# Altium project SVFC.PrjPcb (part 10 of 10)
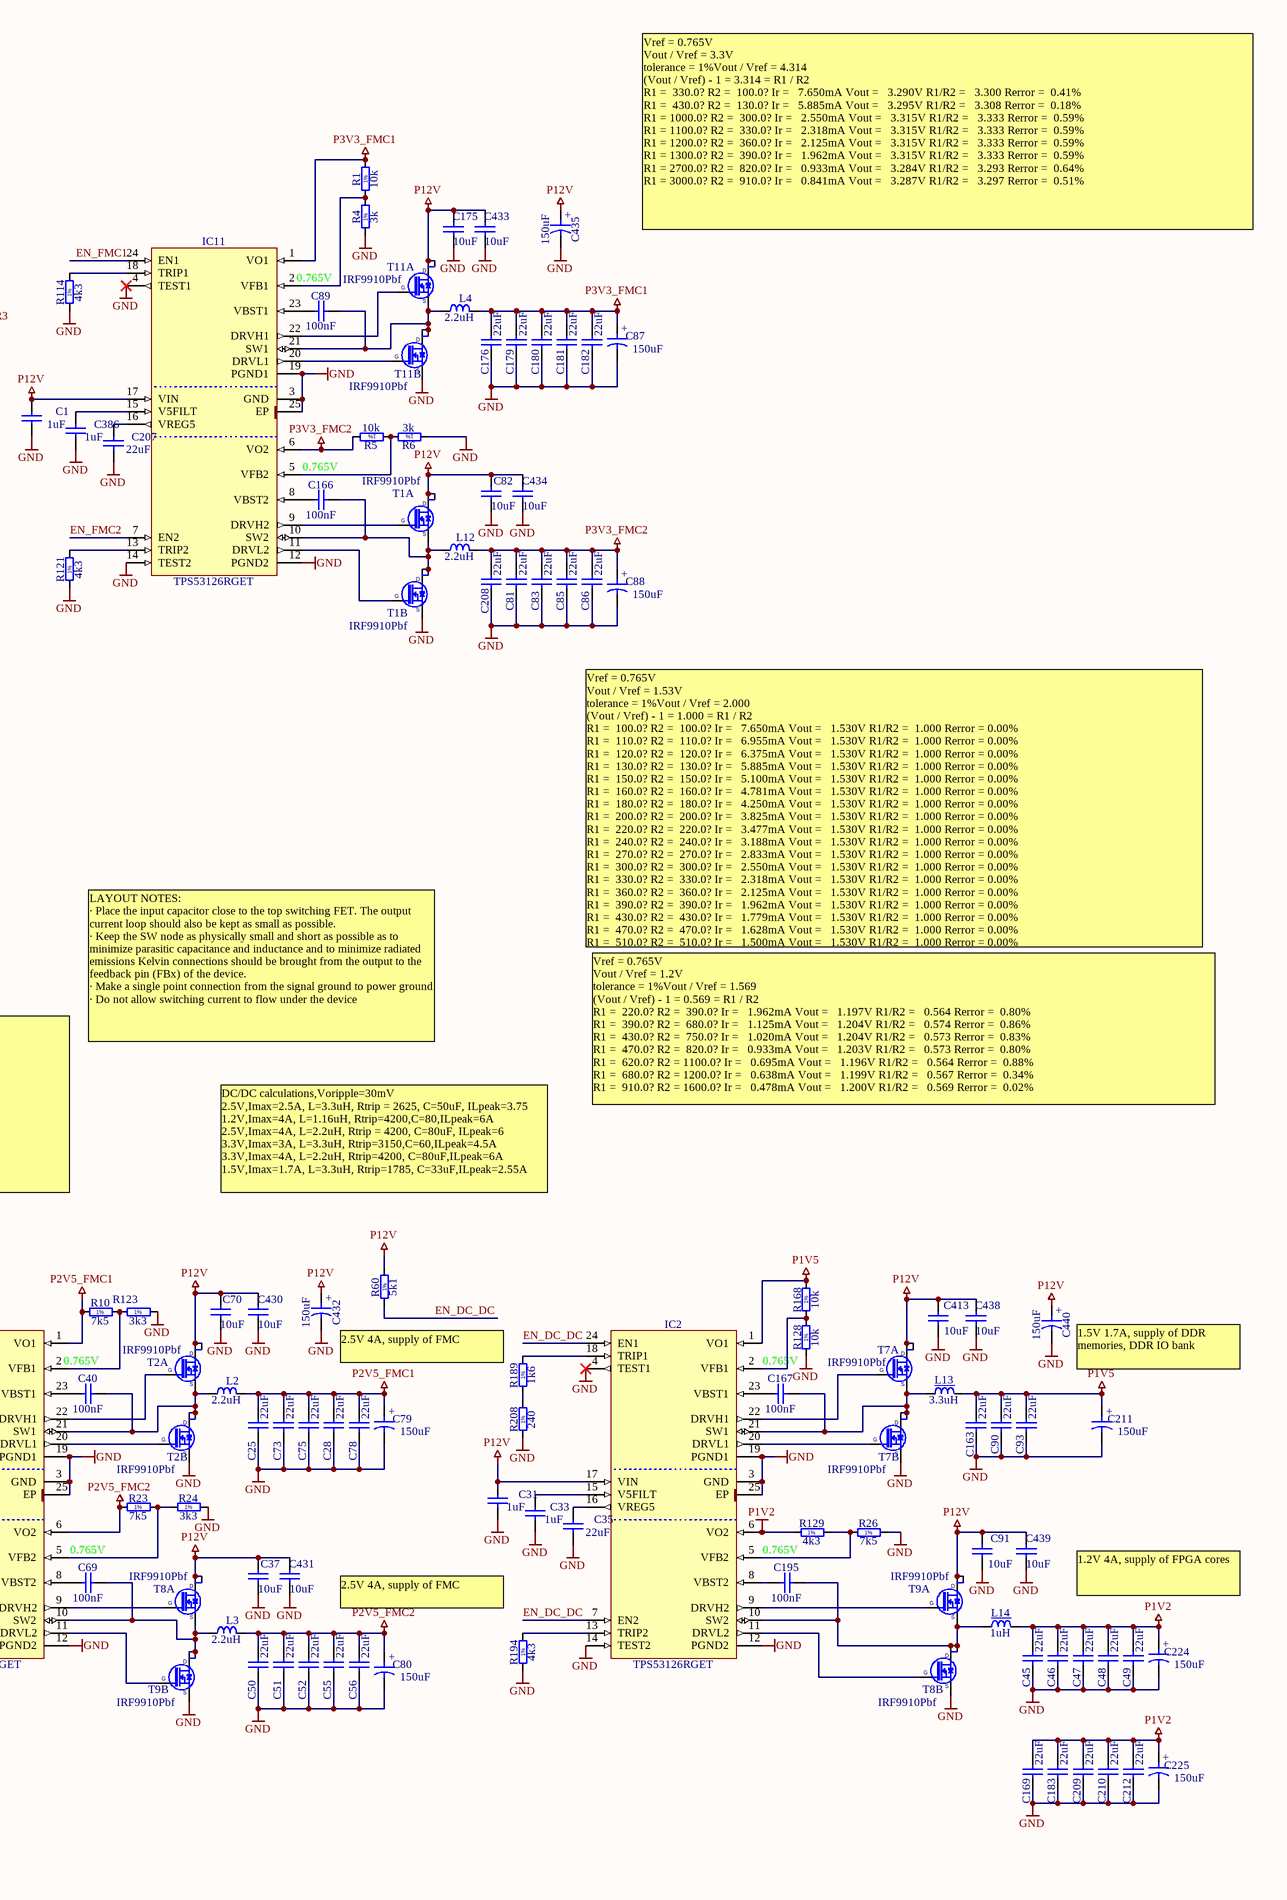
[diagram p120: PowerSupplies.SchDoc, right]

## Nets that join several sheets
GND: VmeConnectors (284 pins), FrontPannel (68 pins), SFPGA (20 pins), ClkGeneration (57 pins), FmcConnector (131 pins), DDR3 (56 pins), JTAG&CONFIG (41 pins), fpga_gtp (32 pins), DDR3_2 (54 pins), SFPGA_power (56 pins), AFPGA_power (227 pins), USB (37 pins), AFPGA (14 pins), PowerSupplies (165 pins)
P1V2: fpga_gtp (L8.1 L9.1), SFPGA_power (18 pins), AFPGA_power (49 pins), PowerSupplies (17 pins)
P1V5: DDR3 (27 pins), DDR3_2 (27 pins), AFPGA_power (25 pins), PowerSupplies (11 pins)
P1V8: USB (7 pins), PowerSupplies (B2.1)
P2V5: JTAG&CONFIG (7 pins), AFPGA_power (47 pins), AFPGA (R14.2 R21.1), PowerSupplies (10 pins)
P2V5_FMC1: FmcConnector (C376.1 J2.g39 J2.h40), PowerSupplies (10 pins)
P2V5_FMC2: FmcConnector (C518.1 J3.g39 J3.h40), PowerSupplies (10 pins)
P3V3: VmeConnectors (191 pins), FrontPannel (36 pins), SFPGA (23 pins), ClkGeneration (8 pins), FmcConnector (9 pins), JTAG&CONFIG (43 pins), SFPGA_power (48 pins), AFPGA_power (84 pins), USB (23 pins), PowerSupplies (19 pins)
P3V3_FMC1: FmcConnector (5 pins), PowerSupplies (10 pins)
P3V3_FMC2: FmcConnector (5 pins), PowerSupplies (10 pins)
P12V_FMC1: FmcConnector (C356.1 J2.c35 J2.c37), PowerSupplies (C24.1 C241.1 F1.2 R108.2)
P12V_FMC2: FmcConnector (C514.1 J3.c35 J3.c37), PowerSupplies (C41.1 C412.1 F3.2 R124.2)
V12P0VME: VmeConnectors (P1.c31), PowerSupplies (8 pins)
VREF_DDR3: DDR3 (9 pins), DDR3_2 (7 pins), PowerSupplies (C68.2 IC8.6)
VTT_DDR3: DDR3 (58 pins), DDR3_2 (58 pins), PowerSupplies (C62.2 C65.2 IC8.3 IC8.5)
2V5_AFPGA_CCLK: JTAG&CONFIG (IC12.1 R202.2), AFPGA (IC19.AJ26)
2V5_AFPGA_CSO_B: JTAG&CONFIG (IC18.3), AFPGA (IC19.AK6)
2V5_AFPGA_INIT_B: JTAG&CONFIG (R199.1 R259.1), AFPGA (IC19.AJ6)
2V5_AFPGA_MISO: JTAG&CONFIG (IC14.4), AFPGA (IC19.AJ25)
2V5_AFPGA_MOSI: JTAG&CONFIG (IC30.3), AFPGA (IC19.AK25)
2V5_AFPGA_PROGRAM: JTAG&CONFIG (R145.1 R192.1), AFPGA (IC19.AB8)
AFPGA_DONE: JTAG&CONFIG (R200.1 R260.1 R322.1 T13.1), AFPGA (IC19.AD25)
AFPGA_M0: JTAG&CONFIG (R201.1), AFPGA (IC19.AK26)
AFPGA_M1: JTAG&CONFIG (R93.1 T12.3), AFPGA (IC19.AG24)
BOOT_CLK: SFPGA (IC40.T9), JTAG&CONFIG (R202.1)
BOOT_CONFIG: SFPGA (IC40.M9), JTAG&CONFIG (R145.2)
BOOT_DONE: SFPGA (IC40.N8), JTAG&CONFIG (R260.2)
BOOT_DOUT: SFPGA (IC40.R9), JTAG&CONFIG (IC14.1 IC30.1)
BOOT_FLASH_CS: SFPGA (IC40.P8), JTAG&CONFIG (IC18.1)
BOOT_SEL0: SFPGA (IC40.B10), JTAG&CONFIG (IC18.6 IC30.6 R184.2)
BOOT_SEL1: SFPGA (IC40.A10), JTAG&CONFIG (IC14.6 R92.2 T12.1)
BOOT_STATUS: SFPGA (IC40.T8), JTAG&CONFIG (R259.2)
CLK20_VCXO: ClkGeneration (R20.2), AFPGA (IC19.V26)
EN_FMC1: SFPGA (IC40.E7), PowerSupplies (IC11.24 IC24.24 R244.2)
EN_FMC2: SFPGA (IC40.E8), PowerSupplies (IC11.7 IC24.7 R195.2)
FLASH_Q: SFPGA (IC40.M10), JTAG&CONFIG (IC6.2 IC14.3 IC29.8)
FMC1_Clk0M2C_N: FmcConnector (J2.h5), AFPGA (IC19.G15)
FMC1_Clk0M2C_P: FmcConnector (J2.h4), AFPGA (IC19.H15)
FMC1_Clk1M2C_N: FmcConnector (J2.g3), AFPGA (IC19.D16)
FMC1_Clk1M2C_P: FmcConnector (J2.g2), AFPGA (IC19.E16)
FMC1_Dp0C2M_N: FmcConnector (J2.c3), fpga_gtp (IC19.AK9)
FMC1_Dp0C2M_P: FmcConnector (J2.c2), fpga_gtp (IC19.AJ9)
FMC1_Dp0M2C_N: FmcConnector (J2.c7), fpga_gtp (IC19.AH10)
FMC1_Dp0M2C_P: FmcConnector (J2.c6), fpga_gtp (IC19.AG10)
FMC1_GBTClk0M2C_N: FmcConnector (J2.d5), fpga_gtp (IC19.AK13)
FMC1_GBTClk0M2C_P: FmcConnector (J2.d4), fpga_gtp (IC19.AJ13)
FMC1_La_N0: FmcConnector (J2.g7), AFPGA (IC19.H13)
FMC1_La_N1: FmcConnector (J2.d9), AFPGA (IC19.G11)
FMC1_La_N2: FmcConnector (J2.h8), AFPGA (IC19.E19)
FMC1_La_N3: FmcConnector (J2.g10), AFPGA (IC19.G19)
FMC1_La_N4: FmcConnector (J2.h11), AFPGA (IC19.J19)
FMC1_La_N5: FmcConnector (J2.d12), AFPGA (IC19.L18)
FMC1_La_N6: FmcConnector (J2.c11), AFPGA (IC19.E15)
FMC1_La_N7: FmcConnector (J2.h14), AFPGA (IC19.G16)
FMC1_La_N8: FmcConnector (J2.g13), AFPGA (IC19.H18)
FMC1_La_N9: FmcConnector (J2.d15), AFPGA (IC19.L19)
FMC1_La_N10: FmcConnector (J2.c15), AFPGA (IC19.H14)
FMC1_La_N11: FmcConnector (J2.h17), AFPGA (IC19.K17)
FMC1_La_N12: FmcConnector (J2.g16), AFPGA (IC19.F18)
FMC1_La_N13: FmcConnector (J2.d18), AFPGA (IC19.E17)
FMC1_La_N14: FmcConnector (J2.c19), AFPGA (IC19.F14)
FMC1_La_N15: FmcConnector (J2.h20), AFPGA (IC19.K15)
FMC1_La_N16: FmcConnector (J2.g19), AFPGA (IC19.G17)
FMC1_La_N17: FmcConnector (J2.d21), AFPGA (IC19.K11)
FMC1_La_N18: FmcConnector (J2.c23), AFPGA (IC19.E13)
FMC1_La_N19: FmcConnector (J2.h23), AFPGA (IC19.E11)
FMC1_La_N20: FmcConnector (J2.g22), AFPGA (IC19.K12)
FMC1_La_N21: FmcConnector (J2.h26), AFPGA (IC19.E9)
FMC1_La_N22: FmcConnector (J2.g25), AFPGA (IC19.A7)
FMC1_La_N23: FmcConnector (J2.d24), AFPGA (IC19.D7)
FMC1_La_N24: FmcConnector (J2.h29), AFPGA (IC19.H8)
FMC1_La_N25: FmcConnector (J2.g28), AFPGA (IC19.J10)
FMC1_La_N26: FmcConnector (J2.d27), AFPGA (IC19.E6)
FMC1_La_N27: FmcConnector (J2.c27), AFPGA (IC19.H12)
FMC1_La_N28: FmcConnector (J2.h32), AFPGA (IC19.F10)
FMC1_La_N29: FmcConnector (J2.g31), AFPGA (IC19.G7)
FMC1_La_N30: FmcConnector (J2.h35), AFPGA (IC19.C8)
FMC1_La_N31: FmcConnector (J2.g34), AFPGA (IC19.E8)
FMC1_La_N32: FmcConnector (J2.h38), AFPGA (IC19.L10)
FMC1_La_N33: FmcConnector (J2.g37), AFPGA (IC19.C6)
FMC1_La_P0: FmcConnector (J2.g6), AFPGA (IC19.J13)
FMC1_La_P1: FmcConnector (J2.d8), AFPGA (IC19.H11)
FMC1_La_P2: FmcConnector (J2.h7), AFPGA (IC19.F19)
FMC1_La_P3: FmcConnector (J2.g9), AFPGA (IC19.H19)
FMC1_La_P4: FmcConnector (J2.h10), AFPGA (IC19.K19)
FMC1_La_P5: FmcConnector (J2.d11), AFPGA (IC19.M18)
FMC1_La_P6: FmcConnector (J2.c10), AFPGA (IC19.F15)
FMC1_La_P7: FmcConnector (J2.h13), AFPGA (IC19.H16)
FMC1_La_P8: FmcConnector (J2.g12), AFPGA (IC19.J18)
FMC1_La_P9: FmcConnector (J2.d14), AFPGA (IC19.M19)
FMC1_La_P10: FmcConnector (J2.c14), AFPGA (IC19.J14)
FMC1_La_P11: FmcConnector (J2.h16), AFPGA (IC19.L17)
FMC1_La_P12: FmcConnector (J2.g15), AFPGA (IC19.G18)
FMC1_La_P13: FmcConnector (J2.d17), AFPGA (IC19.F17)
FMC1_La_P14: FmcConnector (J2.c18), AFPGA (IC19.G14)
FMC1_La_P15: FmcConnector (J2.h19), AFPGA (IC19.M15)
FMC1_La_P16: FmcConnector (J2.g18), AFPGA (IC19.H17)
FMC1_La_P17: FmcConnector (J2.d20), AFPGA (IC19.L11)
FMC1_La_P18: FmcConnector (J2.c22), AFPGA (IC19.F13)
FMC1_La_P19: FmcConnector (J2.h22), AFPGA (IC19.F11)
FMC1_La_P20: FmcConnector (J2.g21), AFPGA (IC19.L12)
FMC1_La_P21: FmcConnector (J2.h25), AFPGA (IC19.F9)
FMC1_La_P22: FmcConnector (J2.g24), AFPGA (IC19.B7)
FMC1_La_P23: FmcConnector (J2.d23), AFPGA (IC19.E7)
FMC1_La_P24: FmcConnector (J2.h28), AFPGA (IC19.J8)
FMC1_La_P25: FmcConnector (J2.g27), AFPGA (IC19.K10)
FMC1_La_P26: FmcConnector (J2.d26), AFPGA (IC19.F6)
FMC1_La_P27: FmcConnector (J2.c26), AFPGA (IC19.J12)
FMC1_La_P28: FmcConnector (J2.h31), AFPGA (IC19.G10)
FMC1_La_P29: FmcConnector (J2.g30), AFPGA (IC19.H7)
FMC1_La_P30: FmcConnector (J2.h34), AFPGA (IC19.D8)
FMC1_La_P31: FmcConnector (J2.g33), AFPGA (IC19.F8)
FMC1_La_P32: FmcConnector (J2.h37), AFPGA (IC19.M10)
FMC1_La_P33: FmcConnector (J2.g36), AFPGA (IC19.D6)
FMC1_PGC2M: SFPGA (IC40.P4 R214.1), FmcConnector (R212.1)
FMC1_PrsntM2C_n: SFPGA (IC40.T4 R137.1), FmcConnector (J2.h2)
FMC1_SCL: SFPGA (IC40.D9), FmcConnector (J2.c30 R29.2)
FMC1_SDA: SFPGA (IC40.F9), FmcConnector (J2.c31 R30.2)
FMC1_TCK: SFPGA (IC40.A8), FmcConnector (J2.d29), JTAG&CONFIG (R262.2)
FMC1_TDI: SFPGA (IC40.C9), FmcConnector (J2.d30), JTAG&CONFIG (W7.2)
FMC1_TDO: SFPGA (IC40.C7), FmcConnector (J2.d31), JTAG&CONFIG (R255.2)
FMC1_TMS: SFPGA (IC40.B8), FmcConnector (J2.d33), JTAG&CONFIG (R258.2)
FMC1_VrefAM2C: FmcConnector (J2.h1), AFPGA (8 pins)
FMC2_Clk0M2C_N: FmcConnector (J3.h5), AFPGA (IC19.AG16)
FMC2_Clk0M2C_P: FmcConnector (J3.h4), AFPGA (IC19.AF16)
FMC2_Clk1M2C_N: FmcConnector (J3.g3), AFPGA (IC19.AK16)
FMC2_Clk1M2C_P: FmcConnector (J3.g2), AFPGA (IC19.AH16)
FMC2_Dp0C2M_N: FmcConnector (J3.c3), fpga_gtp (IC19.AK21)
FMC2_Dp0C2M_P: FmcConnector (J3.c2), fpga_gtp (IC19.AJ21)
FMC2_Dp0M2C_N: FmcConnector (J3.c7), fpga_gtp (IC19.AH20)
FMC2_Dp0M2C_P: FmcConnector (J3.c6), fpga_gtp (IC19.AG20)
FMC2_GBTClk0M2C_N: FmcConnector (J3.d5), fpga_gtp (IC19.AH18)
FMC2_GBTClk0M2C_P: FmcConnector (J3.d4), fpga_gtp (IC19.AG18)
FMC2_La_N0: FmcConnector (J3.g7), AFPGA (IC19.AA15)
FMC2_La_N1: FmcConnector (J3.d9), AFPGA (IC19.AE12)
FMC2_La_N2: FmcConnector (J3.h8), AFPGA (IC19.AK7)
FMC2_La_N3: FmcConnector (J3.g10), AFPGA (IC19.AB9)
FMC2_La_N4: FmcConnector (J3.h11), AFPGA (IC19.AF9)
FMC2_La_N5: FmcConnector (J3.d12), AFPGA (IC19.AE10)
FMC2_La_N6: FmcConnector (J3.c11), AFPGA (IC19.AC12)
FMC2_La_N7: FmcConnector (J3.h14), AFPGA (IC19.AG7)
FMC2_La_N8: FmcConnector (J3.g13), AFPGA (IC19.AE8)
FMC2_La_N9: FmcConnector (J3.d15), AFPGA (IC19.AF11)
FMC2_La_N10: FmcConnector (J3.c15), AFPGA (IC19.AD11)
FMC2_La_N11: FmcConnector (J3.h17), AFPGA (IC19.AH8)
FMC2_La_N12: FmcConnector (J3.g16), AFPGA (IC19.AB11)
FMC2_La_N13: FmcConnector (J3.d18), AFPGA (IC19.AB16)
FMC2_La_N14: FmcConnector (J3.c19), AFPGA (IC19.AF15)
FMC2_La_N15: FmcConnector (J3.h20), AFPGA (IC19.Y12)
FMC2_La_N16: FmcConnector (J3.g19), AFPGA (IC19.Y13)
FMC2_La_N17: FmcConnector (J3.d21), AFPGA (IC19.AA14)
FMC2_La_N18: FmcConnector (J3.c23), AFPGA (IC19.AA21)
FMC2_La_N19: FmcConnector (J3.h23), AFPGA (IC19.AD15)
FMC2_La_N20: FmcConnector (J3.g22), AFPGA (IC19.AE22)
FMC2_La_N21: FmcConnector (J3.h26), AFPGA (IC19.AK15)
FMC2_La_N22: FmcConnector (J3.g25), AFPGA (IC19.AG25)
FMC2_La_N23: FmcConnector (J3.d24), AFPGA (IC19.AC20)
FMC2_La_N24: FmcConnector (J3.h29), AFPGA (IC19.AA17)
FMC2_La_N25: FmcConnector (J3.g28), AFPGA (IC19.AC21)
FMC2_La_N26: FmcConnector (J3.d27), AFPGA (IC19.AF24)
FMC2_La_N27: FmcConnector (J3.c27), AFPGA (IC19.AF23)
FMC2_La_N28: FmcConnector (J3.h32), AFPGA (IC19.AC22)
FMC2_La_N29: FmcConnector (J3.g31), AFPGA (IC19.AD24)
FMC2_La_P0: FmcConnector (J3.g6), AFPGA (IC19.Y15)
FMC2_La_P1: FmcConnector (J3.d8), AFPGA (IC19.AD12)
FMC2_La_P2: FmcConnector (J3.h7), AFPGA (IC19.AH7)
FMC2_La_P3: FmcConnector (J3.g9), AFPGA (IC19.AB10)
FMC2_La_P4: FmcConnector (J3.h10), AFPGA (IC19.AE9)
FMC2_La_P5: FmcConnector (J3.d11), AFPGA (IC19.AD10)
FMC2_La_P6: FmcConnector (J3.c10), AFPGA (IC19.AB12)
FMC2_La_P7: FmcConnector (J3.h13), AFPGA (IC19.AF7)
FMC2_La_P8: FmcConnector (J3.g12), AFPGA (IC19.AD8)
FMC2_La_P9: FmcConnector (J3.d14), AFPGA (IC19.AE11)
FMC2_La_P10: FmcConnector (J3.c14), AFPGA (IC19.AC11)
FMC2_La_P11: FmcConnector (J3.h16), AFPGA (IC19.AG8)
FMC2_La_P12: FmcConnector (J3.g15), AFPGA (IC19.AA11)
FMC2_La_P13: FmcConnector (J3.d17), AFPGA (IC19.Y16)
FMC2_La_P14: FmcConnector (J3.c18), AFPGA (IC19.AE15)
FMC2_La_P15: FmcConnector (J3.h19), AFPGA (IC19.W12)
FMC2_La_P16: FmcConnector (J3.g18), AFPGA (IC19.W14)
FMC2_La_P17: FmcConnector (J3.d20), AFPGA (IC19.Y14)
FMC2_La_P18: FmcConnector (J3.c22), AFPGA (IC19.Y21)
FMC2_La_P19: FmcConnector (J3.h22), AFPGA (IC19.AC15)
FMC2_La_P20: FmcConnector (J3.g21), AFPGA (IC19.AD22)
FMC2_La_P21: FmcConnector (J3.h25), AFPGA (IC19.AJ15)
FMC2_La_P22: FmcConnector (J3.g24), AFPGA (IC19.AF25)
FMC2_La_P23: FmcConnector (J3.d23), AFPGA (IC19.AB20)
FMC2_La_P24: FmcConnector (J3.h28), AFPGA (IC19.Y17)
FMC2_La_P25: FmcConnector (J3.g27), AFPGA (IC19.AB21)
FMC2_La_P26: FmcConnector (J3.d26), AFPGA (IC19.AE24)
FMC2_La_P27: FmcConnector (J3.c26), AFPGA (IC19.AE23)
FMC2_La_P28: FmcConnector (J3.h31), AFPGA (IC19.AA22)
FMC2_La_P29: FmcConnector (J3.g30), AFPGA (IC19.AC24)
FMC2_PGC2M: SFPGA (IC40.M6 R215.1), FmcConnector (R240.1)
FMC2_PrsntM2C_n: SFPGA (IC40.N6 R207.1), FmcConnector (J3.h2)
FMC2_SCL: SFPGA (IC40.B12), FmcConnector (J3.c30 R51.2)
FMC2_SDA: SFPGA (IC40.A12), FmcConnector (J3.c31 R84.2)
FMC2_TCK: SFPGA (IC40.D6), FmcConnector (J3.d29), JTAG&CONFIG (R263.2)
FMC2_TDI: SFPGA (IC40.C6), FmcConnector (J3.d30), JTAG&CONFIG (W8.2)
FMC2_TDO: SFPGA (IC40.E6), FmcConnector (J3.d31), JTAG&CONFIG (W6.3)
FMC2_TMS: SFPGA (IC40.A7), FmcConnector (J3.d33), JTAG&CONFIG (R257.2)
FMC2_VrefAM2C: FmcConnector (J3.h1), AFPGA (10 pins)
FP_GPIO1: FrontPannel (IC16.2 IC16.3), AFPGA (IC19.P27)
FP_GPIO2: FrontPannel (IC16.5 IC16.6), AFPGA (IC19.R29)
FP_GPIO3: FrontPannel (IC16.9), AFPGA (IC19.R30)
FP_GPIO4: FrontPannel (IC16.19), AFPGA (IC19.R27)
FP_LEDN0: FrontPannel (LD24.1), AFPGA (IC19.M24)
FP_LEDN1: FrontPannel (LD24.3), AFPGA (IC19.N29)
FP_LEDN2: FrontPannel (LD24.5), AFPGA (IC19.N30)
FP_LEDN3: FrontPannel (LD24.7), AFPGA (IC19.N27)
FP_LEDN4: FrontPannel (LD25.1), AFPGA (IC19.N28)
FP_LEDN5: FrontPannel (LD25.3), AFPGA (IC19.M23)
FP_LEDN6: FrontPannel (LD25.5), AFPGA (IC19.P28)
FP_LEDN7: FrontPannel (LD25.7), AFPGA (IC19.P30)
FPGA_CLK_N: ClkGeneration (C76.1), AFPGA (IC19.AB30)
FPGA_CLK_P: ClkGeneration (C42.1), AFPGA (IC19.AB28)
FPGA_PLL_REF_CLK0_123_N: ClkGeneration (IC17.47), fpga_gtp (C162.1)
FPGA_PLL_REF_CLK0_123_P: ClkGeneration (IC17.48), fpga_gtp (C266.1)
FPGA_PLL_REF_CLK_101_N: ClkGeneration (IC17.34), fpga_gtp (C267.1)
FPGA_PLL_REF_CLK_101_P: ClkGeneration (IC17.33), fpga_gtp (C165.1)
FPGPIO1_A2B: FrontPannel (IC16.1 IC16.48), AFPGA (IC19.AC28)
FPGPIO2_A2B: FrontPannel (IC16.8 IC16.41), AFPGA (IC19.AC27)
FPGPIO34_A2B: FrontPannel (IC16.24), AFPGA (IC19.AD30)
IO7: USB (IC37.34), AFPGA (IC19.Y25)
LCLK_N: SFPGA (IC40.H5), ClkGeneration (OSC3.3)
NOGA0: SFPGA (IC40.A4 R133.1 SW1.1), AFPGA (IC19.Y26)
NOGA1: SFPGA (IC40.B5 R136.1 SW1.2), AFPGA (IC19.AA28)
NOGA2: SFPGA (IC40.A5 R144.1 SW1.3), AFPGA (IC19.AA27)
NOGA3: SFPGA (IC40.D5 R149.1 SW1.4), AFPGA (IC19.AA30)
NOGA4: SFPGA (IC40.C5 R151.1 SW1.5), AFPGA (IC19.AA29)
OE_SI57X: ClkGeneration (OSC4.2 R152.1), AFPGA (IC19.T28)
P2_DATA_N0: VmeConnectors (P3.a3), AFPGA (IC19.AB19)
P2_DATA_N1: VmeConnectors (P3.a6), AFPGA (IC19.Y20)
P2_DATA_N2: VmeConnectors (P3.a9), AFPGA (IC19.AD19)
P2_DATA_N3: VmeConnectors (P3.a12), AFPGA (IC19.E23)
P2_DATA_N4: VmeConnectors (P3.a15), AFPGA (IC19.K21)
P2_DATA_N5: VmeConnectors (P3.a18), AFPGA (IC19.A25)
P2_DATA_N6: VmeConnectors (P3.a21), AFPGA (IC19.G21)
P2_DATA_N7: VmeConnectors (P3.a24), AFPGA (IC19.C24)
P2_DATA_N8: VmeConnectors (P3.a27), AFPGA (IC19.F22)
P2_DATA_N9: VmeConnectors (P3.a30), AFPGA (IC19.L20)
P2_DATA_N10: VmeConnectors (P3.d3), AFPGA (IC19.Y19)
P2_DATA_N11: VmeConnectors (P3.d6), AFPGA (IC19.AF19)
P2_DATA_N12: VmeConnectors (P3.d9), AFPGA (IC19.D25)
P2_DATA_N13: VmeConnectors (P3.d12), AFPGA (IC19.AE20)
P2_DATA_N14: VmeConnectors (P3.d15), AFPGA (IC19.E21)
P2_DATA_N15: VmeConnectors (P3.d18), AFPGA (IC19.F20)
P2_DATA_N16: VmeConnectors (P3.d21), AFPGA (IC19.AE18)
P2_DATA_N17: VmeConnectors (P3.d24), AFPGA (IC19.AF21)
P2_DATA_N18: VmeConnectors (P3.d27), AFPGA (IC19.J20)
P2_DATA_N19: VmeConnectors (P3.d30), AFPGA (IC19.H22)
P2_DATA_P0: VmeConnectors (P3.a2), AFPGA (IC19.AA19)
P2_DATA_P1: VmeConnectors (P3.a5), AFPGA (IC19.W20)
P2_DATA_P2: VmeConnectors (P3.a8), AFPGA (IC19.AC19)
P2_DATA_P3: VmeConnectors (P3.a11), AFPGA (IC19.F23)
P2_DATA_P4: VmeConnectors (P3.a14), AFPGA (IC19.L21)
P2_DATA_P5: VmeConnectors (P3.a17), AFPGA (IC19.B25)
P2_DATA_P6: VmeConnectors (P3.a20), AFPGA (IC19.H21)
P2_DATA_P7: VmeConnectors (P3.a23), AFPGA (IC19.D24)
P2_DATA_P8: VmeConnectors (P3.a26), AFPGA (IC19.G22)
P2_DATA_P9: VmeConnectors (P3.a29), AFPGA (IC19.M20)
P2_DATA_P10: VmeConnectors (P3.d2), AFPGA (IC19.W19)
P2_DATA_P11: VmeConnectors (P3.d5), AFPGA (IC19.AE19)
P2_DATA_P12: VmeConnectors (P3.d8), AFPGA (IC19.E25)
P2_DATA_P13: VmeConnectors (P3.d11), AFPGA (IC19.AD20)
P2_DATA_P14: VmeConnectors (P3.d14), AFPGA (IC19.F21)
P2_DATA_P15: VmeConnectors (P3.d17), AFPGA (IC19.G20)
P2_DATA_P16: VmeConnectors (P3.d20), AFPGA (IC19.AD18)
P2_DATA_P17: VmeConnectors (P3.d23), AFPGA (IC19.AE21)
P2_DATA_P18: VmeConnectors (P3.d26), AFPGA (IC19.K20)
P2_DATA_P19: VmeConnectors (P3.d29), AFPGA (IC19.J22)
P2_PLLFMC1_CLK_N: VmeConnectors (P3.c26), ClkGeneration (C54.1)
P2_PLLFMC1_CLK_P: VmeConnectors (P3.c25), ClkGeneration (C36.1)
P2_PLLFMC2_CLK_N: VmeConnectors (P3.c30), ClkGeneration (C213.1)
P2_PLLFMC2_CLK_P: VmeConnectors (P3.c29), ClkGeneration (C74.1)
PLL25DAC1_SYNC_N: ClkGeneration (IC7.5), AFPGA (IC19.U29)
PLL25DAC2_SYNC_N: ClkGeneration (IC3.5), AFPGA (IC19.T30)
PLL25DAC_DIN: ClkGeneration (IC3.7 IC7.7), AFPGA (IC19.U30)
PLL25DAC_SCLK: ClkGeneration (IC3.6 IC7.6), AFPGA (IC19.U27)
PLL_2AFPGA_N: ClkGeneration (IC17.36), AFPGA (IC19.AA1)
PLL_2AFPGA_P: ClkGeneration (IC17.35), AFPGA (IC19.AA3)
PLL_2SFPGA_N: SFPGA (IC40.M7), ClkGeneration (IC17.45)
PLL_2SFPGA_P: SFPGA (IC40.P7), ClkGeneration (IC17.46)
PLL_CSN: SFPGA (IC40.R5), ClkGeneration (IC17.17)
PLL_LD: SFPGA (IC40.T5), ClkGeneration (IC17.3)
PLL_REF1: SFPGA (IC40.L8), ClkGeneration (IC17.64)
PLL_REF_SEL: SFPGA (IC40.P5), ClkGeneration (IC17.7)
PLL_RESET_N: SFPGA (IC40.T7), ClkGeneration (IC17.23)
PLL_SCLK: SFPGA (IC40.P6), ClkGeneration (IC17.16)
PLL_SDIO: SFPGA (IC40.L7), ClkGeneration (IC17.22)
PLL_SDO: SFPGA (IC40.T6), ClkGeneration (IC17.21)
PLL_STATUS: SFPGA (IC40.N5), ClkGeneration (IC17.6)
PLL_SYNC_N: SFPGA (IC40.R7), ClkGeneration (IC17.8)
PUSHBUTTON: FrontPannel (C279.2 PB1.3 PB1.4 R86.2), SFPGA (IC40.H4), AFPGA (IC19.P26)
RSTn: SFPGA (IC40.A9), AFPGA (IC19.V28), PowerSupplies (IC23.2)
RSVD0: SFPGA (IC40.C13), AFPGA (IC19.P23)
RSVD1: SFPGA (IC40.A13), AFPGA (IC19.AG29)
RSVD2: SFPGA (IC40.F10), AFPGA (IC19.AG30)
RSVD3: SFPGA (IC40.E11), AFPGA (IC19.P24)
RSVD4: SFPGA (IC40.B14), AFPGA (IC19.P25)
RSVD5: SFPGA (IC40.A14), AFPGA (IC19.AH30)
RSVD6: SFPGA (IC40.D11), AFPGA (IC19.AJ30)
RSVD7: SFPGA (IC40.D12), AFPGA (IC19.R24)
SCL_AFPGA: JTAG&CONFIG (IC31.6 R249.2 R252.2), AFPGA (IC19.Y22)
SCL_SFPGA: SFPGA (IC40.K5), JTAG&CONFIG (IC38.6 R249.1 R253.2)
SDA_AFPGA: JTAG&CONFIG (IC31.5 R245.2 R250.2), AFPGA (IC19.Y23)
SDA_SFPGA: SFPGA (IC40.K6), JTAG&CONFIG (IC38.5 R245.1 R251.2)
SFP_CLK_N: FrontPannel (IC20.4 R105.2), ClkGeneration (C92.1)
SFP_CLK_P: FrontPannel (IC20.3 R105.1), ClkGeneration (C84.1)
SFPGA_CCLK: SFPGA (IC40.R11), JTAG&CONFIG (IC39.6)
SFPGA_CSO_B: SFPGA (IC40.T3), JTAG&CONFIG (IC39.1 R238.1)
SFPGA_INIT_B: SFPGA (IC40.R3), JTAG&CONFIG (B7.1 R286.1)
SFPGA_M0: SFPGA (IC40.T11), JTAG&CONFIG (R219.2)
SFPGA_M1: SFPGA (IC40.N11), JTAG&CONFIG (R220.1)
SFPGA_MISO: SFPGA (IC40.P10), JTAG&CONFIG (R274.2)
SFPGA_MOSI: SFPGA (IC40.T10), JTAG&CONFIG (IC39.5)
SFPRX_123_N: FrontPannel (J4.19), fpga_gtp (IC19.C22)
SFPRX_123_P: FrontPannel (J4.18), fpga_gtp (IC19.D22)
SFPTX_123_N: FrontPannel (J4.12), fpga_gtp (IC19.A23)
SFPTX_123_P: FrontPannel (J4.13), fpga_gtp (IC19.B23)
SI57X_CLK_N: ClkGeneration (OSC4.5), AFPGA (IC19.W27)
SI57X_CLK_P: ClkGeneration (OSC4.4), AFPGA (IC19.W28)
SI57X_SCL: ClkGeneration (OSC4.8 R18.1), AFPGA (IC19.R28)
SI57X_SDA: ClkGeneration (OSC4.7 R19.1), AFPGA (IC19.T26)
SI57X_TUNE: ClkGeneration (R16.2), AFPGA (IC19.T27)
SWITCH0: SFPGA (IC40.A6 R160.1 SW1.7), AFPGA (IC19.Y27)
SWITCH1: SFPGA (IC40.F7 R161.1 SW1.8), AFPGA (IC19.AD28)
UART_RXD: USB (IC34.25), AFPGA (IC19.AJ28)
UART_TXD: USB (IC34.26), AFPGA (IC19.AK28)
USB_CLKOUT: USB (IC37.32), AFPGA (IC19.AG26)
USB_D0: USB (IC37.16), AFPGA (IC19.V23)
USB_D1: USB (IC37.17), AFPGA (IC19.V24)
USB_D2: USB (IC37.18), AFPGA (IC19.AD26)
USB_D3: USB (IC37.19), AFPGA (IC19.AD27)
USB_D4: USB (IC37.21), AFPGA (IC19.W21)
USB_D5: USB (IC37.22), AFPGA (IC19.W22)
USB_D6: USB (IC37.23), AFPGA (IC19.AH27)
USB_D7: USB (IC37.24), AFPGA (IC19.AK27)
USB_OE#: USB (IC37.33), AFPGA (IC19.AE26)
USB_RD#: USB (IC37.28), AFPGA (IC19.Y24)
USB_RXF#: USB (IC37.26), AFPGA (IC19.AH26)
USB_SIWUA: USB (IC37.30), AFPGA (IC19.AA25)
USB_TCK: JTAG&CONFIG (R246.1), USB (IC37.38)
USB_TDI: JTAG&CONFIG (R248.1), USB (IC37.39)
USB_TDO: JTAG&CONFIG (R247.1), USB (IC37.40)
USB_TMS: JTAG&CONFIG (R243.1), USB (IC37.41)
USB_TXE#: USB (IC37.27), AFPGA (IC19.AA24)
USB_WR#: USB (IC37.29), AFPGA (IC19.AE25)
USEGA: SFPGA (IC40.B6 R159.1 SW1.6), AFPGA (IC19.Y30)
VME_A1: VmeConnectors (IC22.22), SFPGA (IC40.M4), AFPGA (IC19.AE3)
VME_A2: VmeConnectors (IC22.20), SFPGA (IC40.M3), AFPGA (IC19.AE1)
VME_A3: VmeConnectors (IC22.19), SFPGA (IC40.M5), AFPGA (IC19.N8)
VME_A4: VmeConnectors (IC22.16), SFPGA (IC40.N4), AFPGA (IC19.N7)
VME_A5: VmeConnectors (IC22.13), SFPGA (IC40.R2), AFPGA (IC19.AC5)
VME_A6: VmeConnectors (IC22.12), SFPGA (IC40.R1), AFPGA (IC19.AC4)
VME_A7: VmeConnectors (IC22.9), SFPGA (IC40.P2), AFPGA (IC19.AD4)
VME_A8: VmeConnectors (IC21.23), SFPGA (IC40.P1), AFPGA (IC19.AD3)
VME_A9: VmeConnectors (IC21.22), SFPGA (IC40.N3), AFPGA (IC19.AB4)
VME_A10: VmeConnectors (IC21.20), SFPGA (IC40.N1), AFPGA (IC19.AB3)
VME_A11: VmeConnectors (IC21.19), SFPGA (IC40.M2), AFPGA (IC19.AD2)
VME_A12: VmeConnectors (IC21.16), SFPGA (IC40.M1), AFPGA (IC19.AD1)
VME_A13: VmeConnectors (IC21.13), SFPGA (IC40.L3), AFPGA (IC19.AC3)
VME_A14: VmeConnectors (IC21.12), SFPGA (IC40.L1), AFPGA (IC19.AC1)
VME_A15: VmeConnectors (IC21.9), SFPGA (IC40.K2), AFPGA (IC19.Y4)
VME_A16: VmeConnectors (IC26.23), SFPGA (IC40.K1), AFPGA (IC19.Y3)
VME_A17: VmeConnectors (IC26.22), SFPGA (IC40.J3), AFPGA (IC19.Y2)
VME_A18: VmeConnectors (IC26.20), SFPGA (IC40.J1), AFPGA (IC19.Y1)
VME_A19: VmeConnectors (IC26.19), SFPGA (IC40.H2), AFPGA (IC19.AA5)
VME_A20: VmeConnectors (IC26.16), SFPGA (IC40.H1), AFPGA (IC19.AA4)
VME_A21: VmeConnectors (IC26.13), SFPGA (IC40.G3), AFPGA (IC19.W3)
VME_A22: VmeConnectors (IC26.12), SFPGA (IC40.G1), AFPGA (IC19.W1)
VME_A23: VmeConnectors (IC26.9), SFPGA (IC40.F2), AFPGA (IC19.V2)
VME_A24: VmeConnectors (IC33.9), SFPGA (IC40.F1), AFPGA (IC19.V1)
VME_A25: VmeConnectors (IC33.12), SFPGA (IC40.K3), AFPGA (IC19.U5)
VME_A26: VmeConnectors (IC33.13), SFPGA (IC40.J4), AFPGA (IC19.U4)
VME_A27: VmeConnectors (IC33.16), SFPGA (IC40.H3), AFPGA (IC19.U3)
VME_A28: VmeConnectors (IC33.19), SFPGA (IC40.L4), AFPGA (IC19.U1)
VME_A29: VmeConnectors (IC33.20), SFPGA (IC40.L5), AFPGA (IC19.T4)
VME_A30: VmeConnectors (IC33.22), SFPGA (IC40.E2), AFPGA (IC19.T3)
VME_A31: VmeConnectors (IC33.23), SFPGA (IC40.E1), AFPGA (IC19.T2)
VME_A_DIR: VmeConnectors (IC21.24 IC22.24 IC26.24 IC33.24), SFPGA (IC40.B2), AFPGA (IC19.N5)
VME_A_OEN: VmeConnectors (5 pins), SFPGA (IC40.A2), AFPGA (IC19.N4)
VME_AM0: VmeConnectors (IC15.9), SFPGA (IC40.M15), AFPGA (IC19.AK2)
VME_AM1: VmeConnectors (IC15.12), SFPGA (IC40.M16), AFPGA (IC19.AE4)
VME_AM2: VmeConnectors (IC15.13), SFPGA (IC40.L14), AFPGA (IC19.AF4)
VME_AM3: VmeConnectors (IC15.16), SFPGA (IC40.L16), AFPGA (IC19.AF3)
VME_AM4: VmeConnectors (IC15.19), SFPGA (IC40.P15), AFPGA (IC19.AG3)
VME_AM5: VmeConnectors (IC15.20), SFPGA (IC40.P16), AFPGA (IC19.V8)
VME_AS: VmeConnectors (IC21.6), SFPGA (IC40.F5), AFPGA (IC19.P6)
VME_BERR: VmeConnectors (IC15.41 R211.2), SFPGA (IC40.C1), AFPGA (IC19.R3)
VME_D0: VmeConnectors (IC25.9), SFPGA (IC40.E13), AFPGA (IC19.AA10)
VME_D1: VmeConnectors (IC25.12), SFPGA (IC40.E12), AFPGA (IC19.AA9)
VME_D2: VmeConnectors (IC25.13), SFPGA (IC40.B15), AFPGA (IC19.AD7)
VME_D3: VmeConnectors (IC25.16), SFPGA (IC40.B16), AFPGA (IC19.AE7)
VME_D4: VmeConnectors (IC25.19), SFPGA (IC40.F12), AFPGA (IC19.Y9)
VME_D5: VmeConnectors (IC25.20), SFPGA (IC40.G11), AFPGA (IC19.Y8)
VME_D6: VmeConnectors (IC25.22), SFPGA (IC40.D14), AFPGA (IC19.AE6)
VME_D7: VmeConnectors (IC25.23), SFPGA (IC40.D16), AFPGA (IC19.AF6)
VME_D8: VmeConnectors (IC5.9), SFPGA (IC40.F13), AFPGA (IC19.W11)
VME_D9: VmeConnectors (IC5.12), SFPGA (IC40.F14), AFPGA (IC19.Y11)
VME_D10: VmeConnectors (IC5.13), SFPGA (IC40.C15), AFPGA (IC19.AE5)
VME_D11: VmeConnectors (IC5.16), SFPGA (IC40.C16), AFPGA (IC19.AG5)
VME_D12: VmeConnectors (IC5.19), SFPGA (IC40.E15), AFPGA (IC19.T7)
VME_D13: VmeConnectors (IC5.20), SFPGA (IC40.E16), AFPGA (IC19.T6)
VME_D14: VmeConnectors (IC5.22), SFPGA (IC40.F15), AFPGA (IC19.AA7)
VME_D15: VmeConnectors (IC5.23), SFPGA (IC40.F16), AFPGA (IC19.AA6)
VME_D16: VmeConnectors (IC35.9), SFPGA (IC40.G14), AFPGA (IC19.AC6)
VME_D17: VmeConnectors (IC35.12), SFPGA (IC40.G16), AFPGA (IC19.AD6)
VME_D18: VmeConnectors (IC35.13), SFPGA (IC40.H15), AFPGA (IC19.AH5)
VME_D19: VmeConnectors (IC35.16), SFPGA (IC40.H16), AFPGA (IC19.AK5)
VME_D20: VmeConnectors (IC35.19), SFPGA (IC40.G12), AFPGA (IC19.W10)
VME_D21: VmeConnectors (IC35.20), SFPGA (IC40.H11), AFPGA (IC19.W9)
VME_D22: VmeConnectors (IC35.22), SFPGA (IC40.H13), AFPGA (IC19.AB7)
VME_D23: VmeConnectors (IC35.23), SFPGA (IC40.H14), AFPGA (IC19.AB6)
VME_D24: VmeConnectors (IC42.9), SFPGA (IC40.J11), AFPGA (IC19.W7)
VME_D25: VmeConnectors (IC42.12), SFPGA (IC40.J12), AFPGA (IC19.W6)
VME_D26: VmeConnectors (IC42.13), SFPGA (IC40.J13), AFPGA (IC19.AJ4)
VME_D27: VmeConnectors (IC42.16), SFPGA (IC40.K14), AFPGA (IC19.AK4)
VME_D28: VmeConnectors (IC42.19), SFPGA (IC40.K12), AFPGA (IC19.T9)
VME_D29: VmeConnectors (IC42.20), SFPGA (IC40.K11), AFPGA (IC19.T8)
VME_D30: VmeConnectors (IC42.22), SFPGA (IC40.J14), AFPGA (IC19.AH3)
VME_D31: VmeConnectors (IC42.23), SFPGA (IC40.J16), AFPGA (IC19.AK3)
VME_D_DIR: VmeConnectors (IC5.24 IC25.24 IC35.24 IC42.24), SFPGA (IC40.F4), AFPGA (IC19.P2)
VME_D_OEN: VmeConnectors (5 pins), SFPGA (IC40.F3), AFPGA (IC19.P1)
VME_DS1: VmeConnectors (IC22.3), SFPGA (IC40.N16), AFPGA (IC19.Y6)
VME_DS2: VmeConnectors (IC22.6), SFPGA (IC40.N14), AFPGA (IC19.Y7)
VME_DTACK: VmeConnectors (IC26.2), SFPGA (IC40.C2), AFPGA (IC19.R5)
VME_DTACK_OE: VmeConnectors (IC26.48), SFPGA (IC40.C3), AFPGA (IC19.T1)
VME_GA0: VmeConnectors (IC27.12), SFPGA (IC40.R15), AFPGA (IC19.V7)
VME_GA1: VmeConnectors (IC27.13), SFPGA (IC40.R16), AFPGA (IC19.AH1)
VME_GA2: VmeConnectors (IC27.16), SFPGA (IC40.R14), AFPGA (IC19.AJ1)
VME_GA3: VmeConnectors (IC27.19), SFPGA (IC40.T15), AFPGA (IC19.V10)
VME_GA4: VmeConnectors (IC27.20), SFPGA (IC40.T14), AFPGA (IC19.V9)
VME_GAP: VmeConnectors (IC27.9), SFPGA (IC40.A3), AFPGA (IC19.M6)
VME_IACK: VmeConnectors (IC25.6), SFPGA (IC40.E3), AFPGA (IC19.N1)
VME_IACKIN: VmeConnectors (IC33.3 R209.2), SFPGA (IC40.F6), AFPGA (IC19.P7)
VME_IACKOUT: VmeConnectors (IC33.5 R209.1), SFPGA (IC40.E4), AFPGA (IC19.N3)
VME_IRQ1: VmeConnectors (IC25.48 R174.1), SFPGA (IC40.T13), AFPGA (IC19.AG4)
VME_IRQ2: VmeConnectors (IC5.41 R191.1), SFPGA (IC40.R12), AFPGA (IC19.AH4)
VME_IRQ3: VmeConnectors (IC5.48 R190.1), SFPGA (IC40.T12), AFPGA (IC19.N10)
VME_IRQ4: VmeConnectors (IC42.41 R185.1), SFPGA (IC40.L12), AFPGA (IC19.N9)
VME_IRQ5: VmeConnectors (IC42.48 R179.1), SFPGA (IC40.L13), AFPGA (IC19.AF2)
VME_IRQ6: VmeConnectors (IC35.41 R177.1), SFPGA (IC40.M13), AFPGA (IC19.AH2)
VME_IRQ7: VmeConnectors (IC35.48 R176.1), SFPGA (IC40.M14), AFPGA (IC19.R7)
VME_LWORD: VmeConnectors (IC22.23), SFPGA (IC40.B3), AFPGA (IC19.M7)
VME_RETRY: VmeConnectors (IC15.2), SFPGA (IC40.D1), AFPGA (IC19.U6)
VME_RETRY_OE: VmeConnectors (IC15.48 R210.2), SFPGA (IC40.D3), AFPGA (IC19.R4)
VME_SYSCLK: VmeConnectors (IC21.3), SFPGA (IC40.G5), AFPGA (IC19.P3)
VME_SYSRESET: VmeConnectors (IC15.22), SFPGA (IC40.G6), AFPGA (IC19.P4)
VME_TCK: VmeConnectors (IC15.23), SFPGA (IC40.C11)
VME_TDI: VmeConnectors (IC27.22), SFPGA (IC40.C10)
VME_TDO: VmeConnectors (IC27.5), SFPGA (IC40.D8)
VME_TDO_OE: VmeConnectors (IC27.41), SFPGA (IC40.A11)
VME_TMS: VmeConnectors (IC27.23), SFPGA (IC40.C8)
VME_TRST: VmeConnectors (IC27.3), SFPGA (IC40.E10)
VME_WRITE: VmeConnectors (IC26.6), SFPGA (IC40.B1), AFPGA (IC19.R1)
WR_LOS: FrontPannel (J4.8 R404.1), AFPGA (IC19.AE27)
WR_MODDEF0: FrontPannel (J4.6 R403.1), AFPGA (IC19.W24)
WR_MODDEF1: FrontPannel (J4.5 R402.1), AFPGA (IC19.W29)
WR_MODDEF2: FrontPannel (J4.4 R401.1), AFPGA (IC19.AE28)
WR_RATESELECT: FrontPannel (R107.2), AFPGA (IC19.W30)
WR_TXDISABLE: FrontPannel (J4.3), AFPGA (IC19.W25)
WR_TXFAULT: FrontPannel (J4.2 R400.1), AFPGA (IC19.R21)